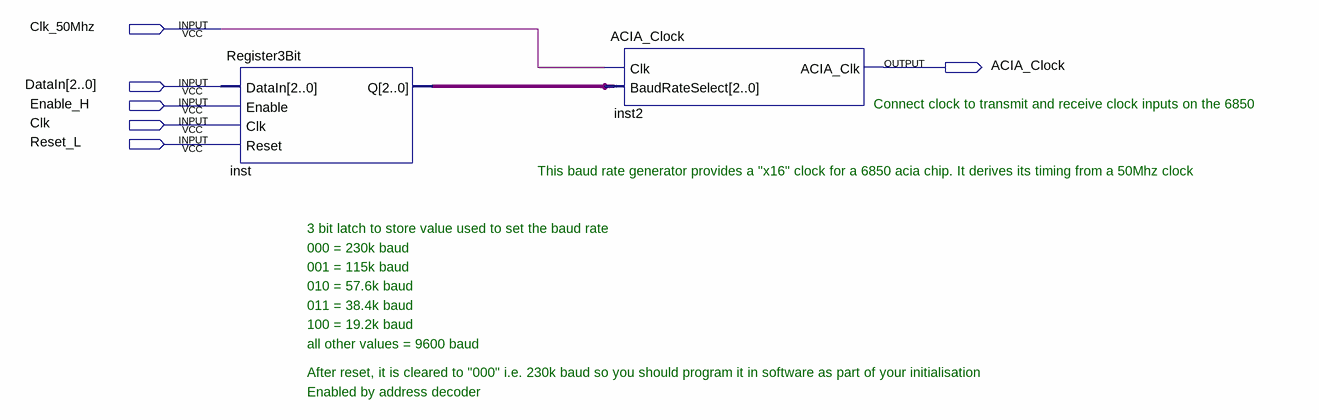
[diagram p0: schematic sheet]
// Quartus schematic ACIA_BaudRate_Generator.bdf as structural Verilog: 2 symbols, 6 pins
module ACIA_BaudRate_Generator (
  input  Clk_50Mhz,
  input  [2:0] DataIn,
  input  Enable_H,
  input  Clk,
  input  Reset_L,
  output ACIA_Clock
);

  wire [2:0] inst_q;

  Register3Bit inst (.DataIn(DataIn), .Enable(Enable_H), .Clk(Clk), .Reset(Reset_L), .Q(inst_q));
  ACIA_Clock inst2 (.Clk(Clk_50Mhz), .BaudRateSelect(inst_q), .ACIA_Clk(ACIA_Clock));

  // Notes on the sheet:
  //   Connect clock to transmit and receive clock inputs on the 6850
  //   This baud rate generator provides a "x16" clock for a 6850 acia chip. It derives its timing from a 50Mhz clock
  //   3 bit latch to store value used to set the baud rate
  //   000 = 230k baud
  //   001 = 115k baud
  //   010 = 57.6k baud
  //   011 = 38.4k baud
  //   100 = 19.2k baud
  //   all other values = 9600 baud
  //   After reset, it is cleared to "000" i.e. 230k baud so you should program it in software as part of your initialisation
  //   Enabled by address decoder
endmodule
